# Altium project Lab_Project.PrjPcb
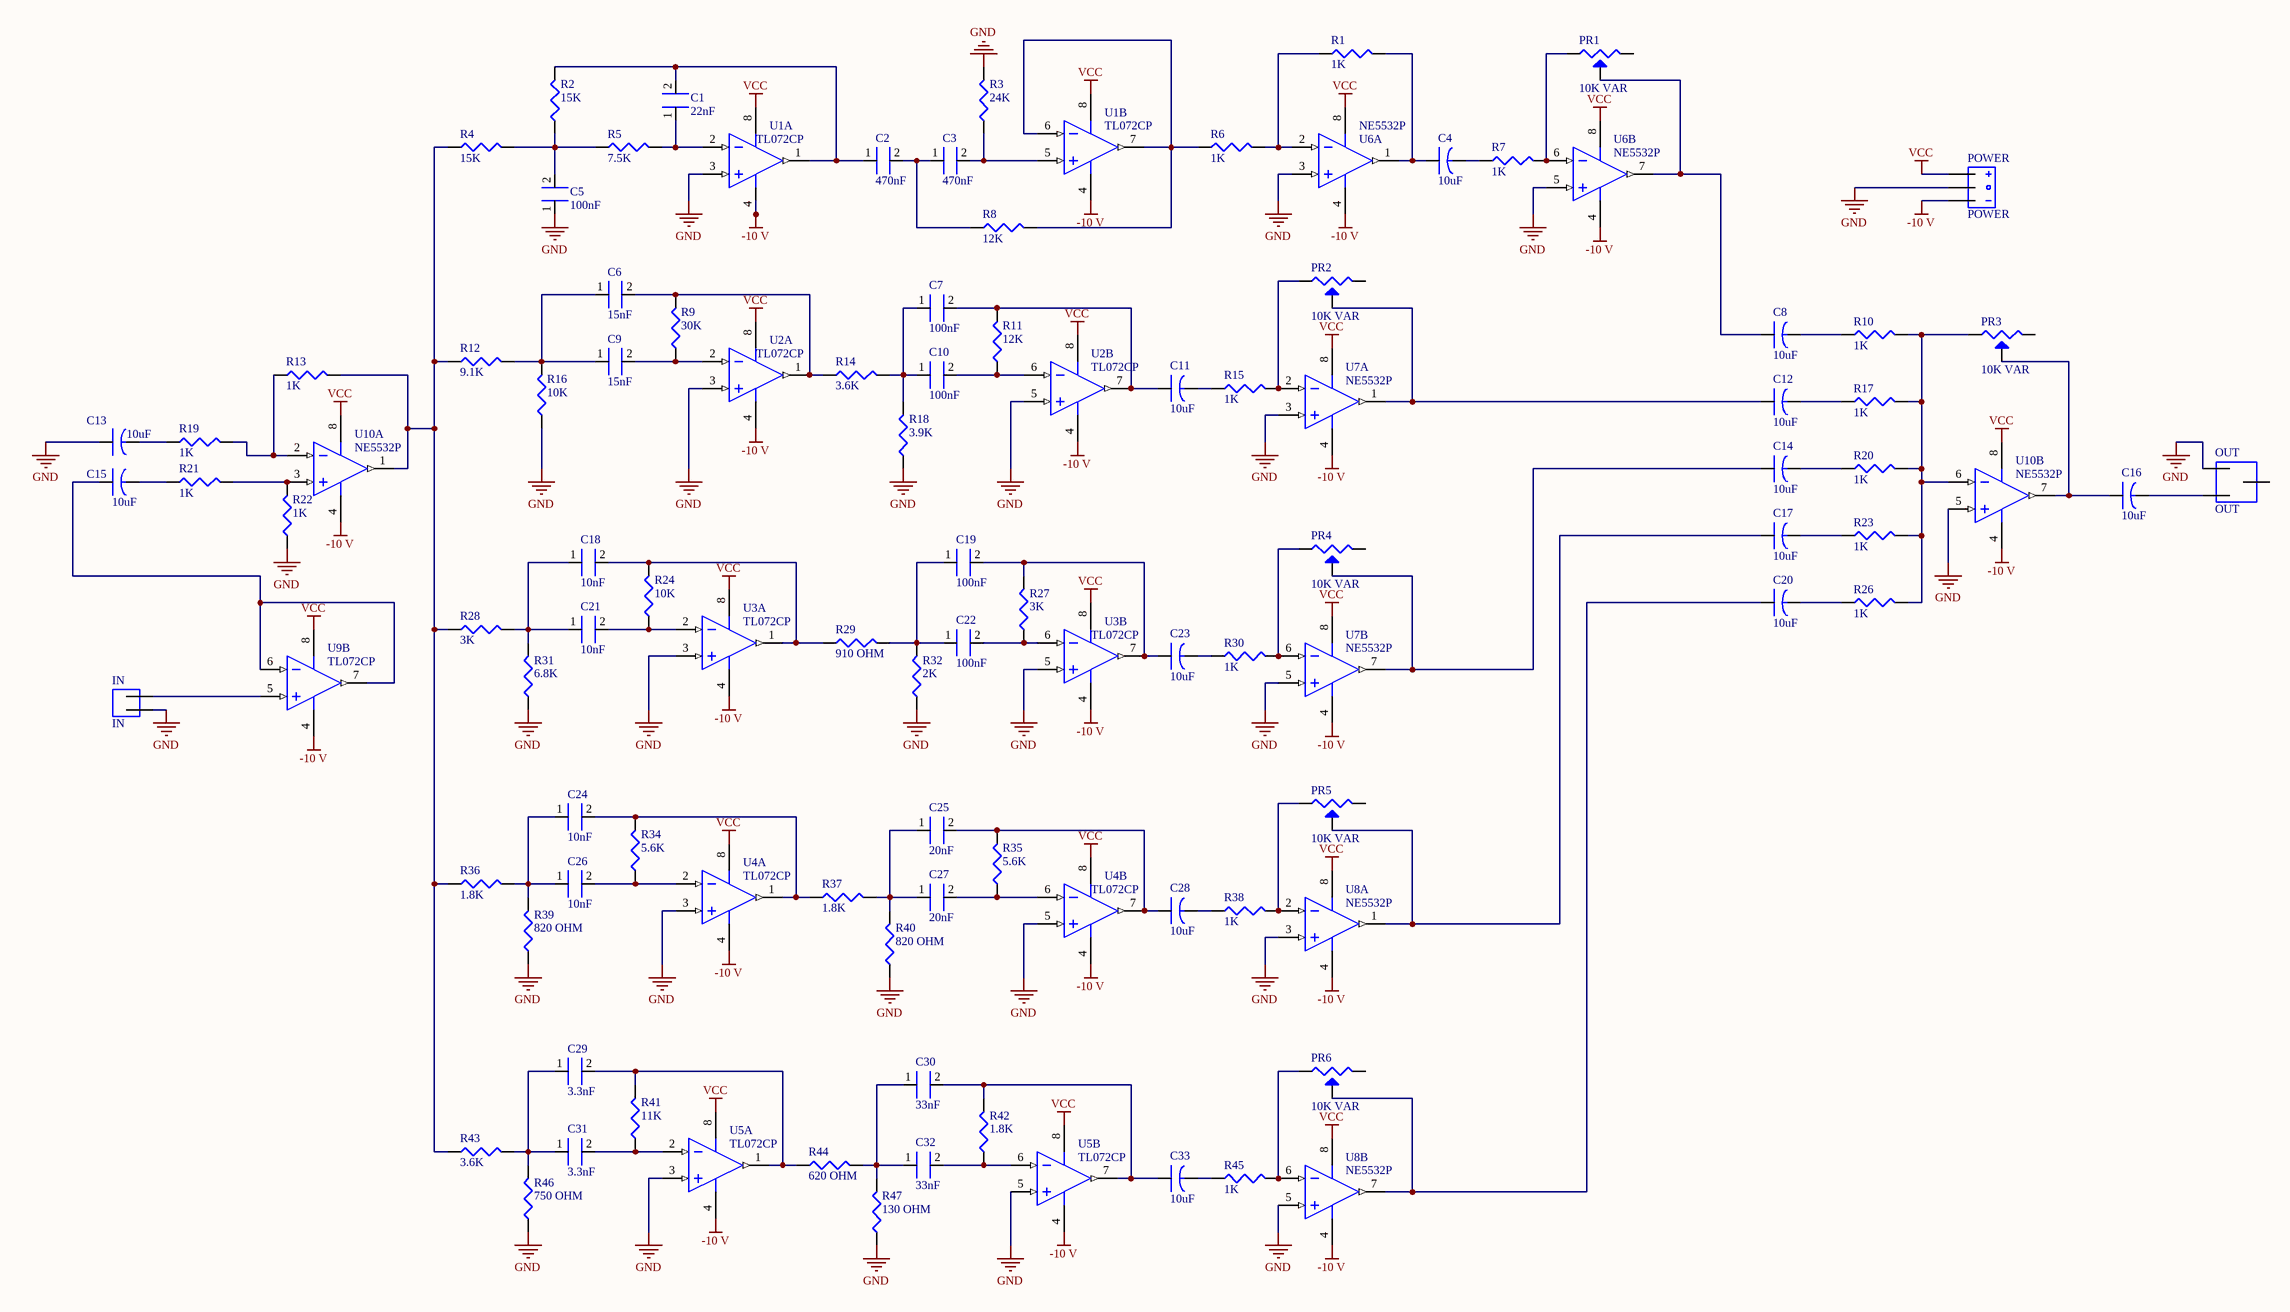
[diagram p0: Sheet1.SchDoc]
1 sheet, 97 parts. Net scope: global (net labels, ports and power ports of the same name join across sheets).
Board file: PCB1.PcbDoc

## Sheet Sheet1.SchDoc
size C; SheetNumber: 1; SheetTotal: 1

### Parts
C1  22nF  [10nF]
C2  470nF  [100nf]
C3  470nF  [100nf]
C4  10uF  [10uF]
C5  100nF  [100nf]
C6  15nF  [10nF]
C7  100nF  [100nf]
C8  10uF  [10uF]
C9  15nF  [10nF]
C10  100nF  [100nf]
C11  10uF  [10uF]
C12  10uF  [10uF]
C13  10uF  [10uF]
C14  10uF  [10uF]
C15  10uF  [10uF]
C16  10uF  [10uF]
C17  10uF  [10uF]
C18  10nF  [10nF]
C19  100nF  [100nf]
C20  10uF  [10uF]
C21  10nF  [10nF]
C22  100nF  [100nf]
C23  10uF  [10uF]
C24  10nF  [10nF]
C25  20nF  [10nF]
C26  10nF  [10nF]
C27  20nF  [10nF]
C28  10uF  [10uF]
C29  3.3nF  [10nF]
C30  33nF  [10nF]
C31  3.3nF  [10nF]
C32  33nF  [10nF]
C33  10uF  [10uF]
IN  IN  [AUDIO_IN]
OUT  OUT  [AUDIO_OUT]
POWER  POWER  [POWER]
PR1  10K VAR  [POT]
PR2  10K VAR  [POT]
PR3  10K VAR  [POT]
PR4  10K VAR  [POT]
PR5  10K VAR  [POT]
PR6  10K VAR  [POT]
R1  1K  [RESI]
R2  15K  [RESI]
R3  24K  [RESI]
R4  15K  [RESI]
R5  7.5K  [RESI]
R6  1K  [RESI]
R7  1K  [RESI]
R8  12K  [RESI]
R9  30K  [RESI]
R10  1K  [RESI]
R11  12K  [RESI]
R12  9.1K  [RESI]
R13  1K  [RESI]
R14  3.6K  [RESI]
R15  1K  [RESI]
R16  10K  [RESI]
R17  1K  [RESI]
R18  3.9K  [RESI]
R19  1K  [RESI]
R20  1K  [RESI]
R21  1K  [RESI]
R22  1K  [RESI]
R23  1K  [RESI]
R24  10K  [RESI]
R26  1K  [RESI]
R27  3K  [RESI]
R28  3K  [RESI]
R29  910 OHM  [RESI]
R30  1K  [RESI]
R31  6.8K  [RESI]
R32  2K  [RESI]
R34  5.6K  [RESI]
R35  5.6K  [RESI]
R36  1.8K  [RESI]
R37  1.8K  [RESI]
R38  1K  [RESI]
R39  820 OHM  [RESI]
R40  820 OHM  [RESI]
R41  11K  [RESI]
R42  1.8K  [RESI]
R43  3.6K  [RESI]
R44  620 OHM  [RESI]
R45  1K  [RESI]
R46  750 OHM  [RESI]
R47  130 OHM  [RESI]
U1  TL072CP  [TL0072CP]  (parts A,B of 2)
U2  TL072CP  [TL0072CP]  (parts A,B of 2)
U3  TL072CP  [TL0072CP]  (parts A,B of 2)
U4  TL072CP  [TL0072CP]  (parts A,B of 2)
U5  TL072CP  [TL0072CP]  (parts A,B of 2)
U6  NE5532P  [NE5532P]  (parts A,B of 2)
U7  NE5532P  [NE5532P]  (parts A,B of 2)
U8  NE5532P  [NE5532P]  (parts A,B of 2)
U9  TL072CP  [TL0072CP]  (part B of 2)
U10  NE5532P  [NE5532P]  (parts A,B of 2)

### Nets
-10 V: POWER.3 U1.4(VCC-) U2.4(VCC-) U3.4(VCC-) U4.4(VCC-) U5.4(VCC-) U6.4(VCC-) U7.4(VCC-) U8.4(VCC-) U9.4(VCC-) U10.4(VCC-)
GND: C5.1 C13.1 IN.1 OUT.2 POWER.2 R3.2 R16.1 R18.1 R22.1 R31.1 R32.1 R39.1 R40.1 R46.1 R47.1 U1.3(IN1+) U2.3(IN1+) U2.5(IN2+) U3.3(IN1+) U3.5(IN2+) U4.3(IN1+) U4.5(IN2+) U5.3(IN1+) U5.5(IN2+) U6.3(IN1+) U6.5(IN2+) U7.3(IN1+) U7.5(IN2+) U8.3(IN1+) U8.5(IN2+) U10.5(IN2+)
VCC: POWER.1 U1.8(VCC+) U2.8(VCC+) U3.8(VCC+) U4.8(VCC+) U5.8(VCC+) U6.8(VCC+) U7.8(VCC+) U8.8(VCC+) U9.8(VCC+) U10.8(VCC+)
NetC1_1: C1.1 R5.2 U1.2(IN1-)
NetC1_2: C1.2 C2.1 R2.2 U1.1(OUT1)
NetC2_2: C2.2 C3.1 R8.1
NetC3_2: C3.2 R3.1 U1.5(IN2+)
NetC4_1: C4.1 R1.2 U6.1(OUT1)
NetC4_2: C4.2 R7.1
NetC5_2: C5.2 R2.1 R4.2 R5.1
NetC6_1: C6.1 C9.1 R12.2 R16.2
NetC6_2: C6.2 R9.2 R14.1 U2.1(OUT1)
NetC7_1: C7.1 C10.1 R14.2 R18.2
NetC7_2: C7.2 C11.1 R11.2 U2.7(OUT2)
NetC8_1: C8.1 PR1.2 U6.7(OUT2)
NetC8_2: C8.2 R10.1
NetC9_2: C9.2 R9.1 U2.2(IN1-)
NetC10_2: C10.2 R11.1 U2.6(IN2-)
NetC11_2: C11.2 R15.1
NetC12_1: C12.1 PR2.2 U7.1(OUT1)
NetC12_2: C12.2 R17.1
NetC13_2: C13.2 R19.1
NetC14_1: C14.1 PR4.2 U7.7(OUT2)
NetC14_2: C14.2 R20.1
NetC15_1: C15.1 U9.6(IN2-) U9.7(OUT2)
NetC15_2: C15.2 R21.1
NetC16_1: C16.1 PR3.2 U10.7(OUT2)
NetC16_2: C16.2 OUT.3
NetC17_1: C17.1 PR5.2 U8.1(OUT1)
NetC17_2: C17.2 R23.1
NetC18_1: C18.1 C21.1 R28.2 R31.2
NetC18_2: C18.2 R24.2 R29.1 U3.1(OUT1)
NetC19_1: C19.1 C22.1 R29.2 R32.2
NetC19_2: C19.2 C23.1 R27.2 U3.7(OUT2)
NetC20_1: C20.1 PR6.2 U8.7(OUT2)
NetC20_2: C20.2 R26.1
NetC21_2: C21.2 R24.1 U3.2(IN1-)
NetC22_2: C22.2 R27.1 U3.6(IN2-)
NetC23_2: C23.2 R30.1
NetC24_1: C24.1 C26.1 R36.2 R39.2
NetC24_2: C24.2 R34.2 R37.1 U4.1(OUT1)
NetC25_1: C25.1 C27.1 R37.2 R40.2
NetC25_2: C25.2 C28.1 R35.2 U4.7(OUT2)
NetC26_2: C26.2 R34.1 U4.2(IN1-)
NetC27_2: C27.2 R35.1 U4.6(IN2-)
NetC28_2: C28.2 R38.1
NetC29_1: C29.1 C31.1 R43.2 R46.2
NetC29_2: C29.2 R41.2 R44.1 U5.1(OUT1)
NetC30_1: C30.1 C32.1 R44.2 R47.2
NetC30_2: C30.2 C33.1 R42.2 U5.7(OUT2)
NetC31_2: C31.2 R41.1 U5.2(IN1-)
NetC32_2: C32.2 R42.1 U5.6(IN2-)
NetC33_2: C33.2 R45.1
NetIN_2: IN.2 U9.5(IN2+)
NetPR1_1: PR1.1 R7.2 U6.6(IN2-)
NetPR2_1: PR2.1 R15.2 U7.2(IN1-)
NetPR3_1: PR3.1 R10.2 R17.2 R20.2 R23.2 R26.2 U10.6(IN2-)
NetPR4_1: PR4.1 R30.2 U7.6(IN2-)
NetPR5_1: PR5.1 R38.2 U8.2(IN1-)
NetPR6_1: PR6.1 R45.2 U8.6(IN2-)
NetR1_1: R1.1 R6.2 U6.2(IN1-)
NetR4_1: R4.1 R12.1 R13.2 R28.1 R36.1 R43.1 U10.1(OUT1)
NetR6_1: R6.1 R8.2 U1.6(IN2-) U1.7(OUT2)
NetR13_1: R13.1 R19.2 U10.2(IN1-)
NetR21_2: R21.2 R22.2 U10.3(IN1+)

Not connected (* = marked no-connect by the designer): OUT 1; PR1 3; PR2 3; PR3 3; PR4 3; PR5 3; PR6 3

### Library data of the parts
C1 = 22nF: Manufacturer: Nichicon; Manufacturer Part Number: UKW1H0R1MDD1TD; Capacitance: 100nF; Tolerance: 20%; Voltage Rating: 50V; Ripple Current: 1.1mA; Life (Hours): 2000Hour; Supplier 1: Digi-Key; RoHS: Yes; Category: Aluminum Electrolytic Capacitors; Stock 1: 3707; Pricing 1: 1=0.39000, 10=0.26600, 50=0.17720, 100=0.15050, 500=0.10626, 1000=0.09298 (USD); Mount: Through Hole; Case/Package: Radial; Min Operating Temperature: -40°C; Max Operating Temperature: 85°C; Package Quantity: 1; Packaging: Cut Tape; Lead Pitch: 0.079inch; Height - Seated (Max): 0.492inch; RoHS Compliant: Yes; ComponentLink1URL: https://datasheet.ciiva.com/29550/e-kw-29550927.pdf?src-supplier=Digi-Key; ComponentLink1Description: https://datasheet.ciiva.com/29550/e-kw-29550927.pdf?src-supplier=Digi-Key; Supplier Part Number 1: 493-10793-1-ND
C2 C3 = 470nF: Manufacturer: Nichicon; Manufacturer Part Number: UKW1H0R1MDD1TD; Tolerance: 20%; Voltage Rating: 50V; Ripple Current: 1.1mA; Life (Hours): 2000Hour; Supplier 1: Digi-Key; RoHS: Yes; Category: Aluminum Electrolytic Capacitors; Stock 1: 3707; Pricing 1: 1=0.39000, 10=0.26600, 50=0.17720, 100=0.15050, 500=0.10626, 1000=0.09298 (USD); Mount: Through Hole; Case/Package: Radial; Min Operating Temperature: -40°C; Max Operating Temperature: 85°C; Package Quantity: 1; Packaging: Cut Tape; Capacitance: 100nF; Lead Pitch: 0.079inch; Height - Seated (Max): 0.492inch; RoHS Compliant: Yes; ComponentLink1URL: https://datasheet.ciiva.com/29550/e-kw-29550927.pdf?src-supplier=Digi-Key; ComponentLink1Description: https://datasheet.ciiva.com/29550/e-kw-29550927.pdf?src-supplier=Digi-Key; Supplier Part Number 1: 493-10793-1-ND
C4 C8 C11-C17 C20 C23 C28 C33 = 10uF: YXF series 50V 10uF 5x11mm LS=2mm 105'C 10k HRS Aluminum Electrolytic Capacitor; Manufacturer: Rubycon; Manufacturer Part Number: 50YXF10MEFC5X11; Dielectric Material: Aluminium; Tolerance: 20%; Impedance: 1.5R; Ripple Current: 100mA; Life (Hours): 5000Hour; Supplier 1: Digi-Key; RoHS: Yes; Category: Aluminum Electrolytic Capacitors; Stock 1: 126340; Pricing 1: 1=0.31000, 10=0.21000, 50=0.12580, 100=0.10620, 500=0.07266, 1000=0.06427, 2500=0.06148, 5000=0.05589 (USD); Mount: Through Hole; Case/Package: Radial; Min Operating Temperature: -40°C; Max Operating Temperature: 105°C; Package Quantity: 3000; Capacitance: 10uF; Voltage Rating: 50V; Packaging: Bulk; Termination: Radial; Series: YXF; Diameter: 5mm; Height: 11mm; Lead Pitch: 2mm; Height - Seated (Max): 0.492inch; Radiation Hardening: No; RoHS Compliant: Yes; ComponentLink1URL: https://datasheet.ciiva.com/7976/e-yxf-7976037.pdf?src-supplier=Element14; ComponentLink1Description: https://datasheet.ciiva.com/7976/e-yxf-7976037.pdf?src-supplier=Element14; ComponentLink2URL: https://datasheet.ciiva.com/6310/e-yxf-6310901.pdf?src-supplier=Digi-Key; ComponentLink2Description: https://datasheet.ciiva.com/6310/e-yxf-6310901.pdf?src-supplier=Digi-Key; Supplier Part Number 1: 1189-1852-ND
C5 C7 C10 C19 C22 = 100nF: Manufacturer: Nichicon; Manufacturer Part Number: UKW1H0R1MDD1TD; Tolerance: 20%; Voltage Rating: 50V; Ripple Current: 1.1mA; Life (Hours): 2000Hour; Supplier 1: Digi-Key; RoHS: Yes; Category: Aluminum Electrolytic Capacitors; Stock 1: 3707; Pricing 1: 1=0.39000, 10=0.26600, 50=0.17720, 100=0.15050, 500=0.10626, 1000=0.09298 (USD); Mount: Through Hole; Case/Package: Radial; Min Operating Temperature: -40°C; Max Operating Temperature: 85°C; Package Quantity: 1; Packaging: Cut Tape; Capacitance: 100nF; Lead Pitch: 0.079inch; Height - Seated (Max): 0.492inch; RoHS Compliant: Yes; ComponentLink1URL: https://datasheet.ciiva.com/29550/e-kw-29550927.pdf?src-supplier=Digi-Key; ComponentLink1Description: https://datasheet.ciiva.com/29550/e-kw-29550927.pdf?src-supplier=Digi-Key; Supplier Part Number 1: 493-10793-1-ND
C6 C9 = 15nF: Manufacturer: Nichicon; Manufacturer Part Number: UKW1H0R1MDD1TD; Capacitance: 100nF; Tolerance: 20%; Voltage Rating: 50V; Ripple Current: 1.1mA; Life (Hours): 2000Hour; Supplier 1: Digi-Key; RoHS: Yes; Category: Aluminum Electrolytic Capacitors; Stock 1: 3707; Pricing 1: 1=0.39000, 10=0.26600, 50=0.17720, 100=0.15050, 500=0.10626, 1000=0.09298 (USD); Mount: Through Hole; Case/Package: Radial; Min Operating Temperature: -40°C; Max Operating Temperature: 85°C; Package Quantity: 1; Packaging: Cut Tape; Lead Pitch: 0.079inch; Height - Seated (Max): 0.492inch; RoHS Compliant: Yes; ComponentLink1URL: https://datasheet.ciiva.com/29550/e-kw-29550927.pdf?src-supplier=Digi-Key; ComponentLink1Description: https://datasheet.ciiva.com/29550/e-kw-29550927.pdf?src-supplier=Digi-Key; Supplier Part Number 1: 493-10793-1-ND
C18 C21 C24 C26 = 10nF: Manufacturer: Nichicon; Manufacturer Part Number: UKW1H0R1MDD1TD; Capacitance: 100nF; Tolerance: 20%; Voltage Rating: 50V; Ripple Current: 1.1mA; Life (Hours): 2000Hour; Supplier 1: Digi-Key; RoHS: Yes; Category: Aluminum Electrolytic Capacitors; Stock 1: 3707; Pricing 1: 1=0.39000, 10=0.26600, 50=0.17720, 100=0.15050, 500=0.10626, 1000=0.09298 (USD); Mount: Through Hole; Case/Package: Radial; Min Operating Temperature: -40°C; Max Operating Temperature: 85°C; Package Quantity: 1; Packaging: Cut Tape; Lead Pitch: 0.079inch; Height - Seated (Max): 0.492inch; RoHS Compliant: Yes; ComponentLink1URL: https://datasheet.ciiva.com/29550/e-kw-29550927.pdf?src-supplier=Digi-Key; ComponentLink1Description: https://datasheet.ciiva.com/29550/e-kw-29550927.pdf?src-supplier=Digi-Key; Supplier Part Number 1: 493-10793-1-ND
C25 C27 = 20nF: Manufacturer: Nichicon; Manufacturer Part Number: UKW1H0R1MDD1TD; Capacitance: 100nF; Tolerance: 20%; Voltage Rating: 50V; Ripple Current: 1.1mA; Life (Hours): 2000Hour; Supplier 1: Digi-Key; RoHS: Yes; Category: Aluminum Electrolytic Capacitors; Stock 1: 3707; Pricing 1: 1=0.39000, 10=0.26600, 50=0.17720, 100=0.15050, 500=0.10626, 1000=0.09298 (USD); Mount: Through Hole; Case/Package: Radial; Min Operating Temperature: -40°C; Max Operating Temperature: 85°C; Package Quantity: 1; Packaging: Cut Tape; Lead Pitch: 0.079inch; Height - Seated (Max): 0.492inch; RoHS Compliant: Yes; ComponentLink1URL: https://datasheet.ciiva.com/29550/e-kw-29550927.pdf?src-supplier=Digi-Key; ComponentLink1Description: https://datasheet.ciiva.com/29550/e-kw-29550927.pdf?src-supplier=Digi-Key; Supplier Part Number 1: 493-10793-1-ND
C29 C31 = 3.3nF: Manufacturer: Nichicon; Manufacturer Part Number: UKW1H0R1MDD1TD; Capacitance: 100nF; Tolerance: 20%; Voltage Rating: 50V; Ripple Current: 1.1mA; Life (Hours): 2000Hour; Supplier 1: Digi-Key; RoHS: Yes; Category: Aluminum Electrolytic Capacitors; Stock 1: 3707; Pricing 1: 1=0.39000, 10=0.26600, 50=0.17720, 100=0.15050, 500=0.10626, 1000=0.09298 (USD); Mount: Through Hole; Case/Package: Radial; Min Operating Temperature: -40°C; Max Operating Temperature: 85°C; Package Quantity: 1; Packaging: Cut Tape; Lead Pitch: 0.079inch; Height - Seated (Max): 0.492inch; RoHS Compliant: Yes; ComponentLink1URL: https://datasheet.ciiva.com/29550/e-kw-29550927.pdf?src-supplier=Digi-Key; ComponentLink1Description: https://datasheet.ciiva.com/29550/e-kw-29550927.pdf?src-supplier=Digi-Key; Supplier Part Number 1: 493-10793-1-ND
C30 C32 = 33nF: Manufacturer: Nichicon; Manufacturer Part Number: UKW1H0R1MDD1TD; Capacitance: 100nF; Tolerance: 20%; Voltage Rating: 50V; Ripple Current: 1.1mA; Life (Hours): 2000Hour; Supplier 1: Digi-Key; RoHS: Yes; Category: Aluminum Electrolytic Capacitors; Stock 1: 3707; Pricing 1: 1=0.39000, 10=0.26600, 50=0.17720, 100=0.15050, 500=0.10626, 1000=0.09298 (USD); Mount: Through Hole; Case/Package: Radial; Min Operating Temperature: -40°C; Max Operating Temperature: 85°C; Package Quantity: 1; Packaging: Cut Tape; Lead Pitch: 0.079inch; Height - Seated (Max): 0.492inch; RoHS Compliant: Yes; ComponentLink1URL: https://datasheet.ciiva.com/29550/e-kw-29550927.pdf?src-supplier=Digi-Key; ComponentLink1Description: https://datasheet.ciiva.com/29550/e-kw-29550927.pdf?src-supplier=Digi-Key; Supplier Part Number 1: 493-10793-1-ND
IN = A_IN
OUT = AUDIO
R1 R6 R7 R10 R13 R15 R17 R19-R23 R26 R30 R38 R45 = 1K: RES 1K OHM 5% 1/2W AXIAL; Manufacturer: Yageo; Manufacturer Part Number: CFR-25JB-52-10K; Resistance: 10kR; Temperature Coefficient: 500ppm/°C; Max Power Dissipation: 250mW; Supplier 1: Digi-Key; RoHS: Yes; Category: Through-Hole Resistors; Stock 1: 199228; Pricing 1: 1=0.10000, 10=0.06800, 25=0.04680, 50=0.03640, 100=0.02600, 250=0.02028, 500=0.01612, 1000=0.01144, 5000=0.00884 (USD); Case/Package: Axial; Min Operating Temperature: -55°C; Max Operating Temperature: 155°C; Package Quantity: 200; Packaging: Bulk; Tolerance: 5%; Resistor Type: Carbon Film; Number of Terminations: 2; Series: Carbon Film; Length: 0.248inch; RoHS Compliant: Yes; Lead Free: Lead Free; ComponentLink1URL: http://www.yageo.com/NewPortal/yageodocoutput?fileName=/pdf/throughhole/Yageo_LR_CFR_2013.pdf&src-supplier=Digi-Key; ComponentLink1Description: http://www.yageo.com/NewPortal/yageodocoutput?fileName=/pdf/throughhole/Yageo_LR_CFR_2013.pdf&src-supplier=Digi-Key; Supplier Part Number 1: CF14JT1K00CT-ND
R2 R4 = 15K: RES 15K OHM 5% 1/2W AXIAL; Manufacturer: Yageo; Manufacturer Part Number: CFR-25JB-52-10K; Resistance: 10kR; Temperature Coefficient: 500ppm/°C; Max Power Dissipation: 250mW; Supplier 1: Digi-Key; RoHS: Yes; Category: Through-Hole Resistors; Stock 1: 199228; Pricing 1: 1=0.10000, 10=0.06800, 25=0.04680, 50=0.03640, 100=0.02600, 250=0.02028, 500=0.01612, 1000=0.01144, 5000=0.00884 (USD); Case/Package: Axial; Min Operating Temperature: -55°C; Max Operating Temperature: 155°C; Package Quantity: 200; Packaging: Bulk; Tolerance: 5%; Resistor Type: Carbon Film; Number of Terminations: 2; Series: Carbon Film; Length: 0.248inch; RoHS Compliant: Yes; Lead Free: Lead Free; ComponentLink1URL: http://www.yageo.com/NewPortal/yageodocoutput?fileName=/pdf/throughhole/Yageo_LR_CFR_2013.pdf&src-supplier=Digi-Key; ComponentLink1Description: http://www.yageo.com/NewPortal/yageodocoutput?fileName=/pdf/throughhole/Yageo_LR_CFR_2013.pdf&src-supplier=Digi-Key; Supplier Part Number 1: 10KQBK-ND
R3 = 24K: RES 24K OHM 5% 1/2W AXIAL; Manufacturer: Yageo; Manufacturer Part Number: CFR-25JB-52-10K; Resistance: 10kR; Temperature Coefficient: 500ppm/°C; Max Power Dissipation: 250mW; Supplier 1: Digi-Key; RoHS: Yes; Category: Through-Hole Resistors; Stock 1: 199228; Pricing 1: 1=0.10000, 10=0.06800, 25=0.04680, 50=0.03640, 100=0.02600, 250=0.02028, 500=0.01612, 1000=0.01144, 5000=0.00884 (USD); Case/Package: Axial; Min Operating Temperature: -55°C; Max Operating Temperature: 155°C; Package Quantity: 200; Packaging: Bulk; Tolerance: 5%; Resistor Type: Carbon Film; Number of Terminations: 2; Series: Carbon Film; Length: 0.248inch; RoHS Compliant: Yes; Lead Free: Lead Free; ComponentLink1URL: http://www.yageo.com/NewPortal/yageodocoutput?fileName=/pdf/throughhole/Yageo_LR_CFR_2013.pdf&src-supplier=Digi-Key; ComponentLink1Description: http://www.yageo.com/NewPortal/yageodocoutput?fileName=/pdf/throughhole/Yageo_LR_CFR_2013.pdf&src-supplier=Digi-Key; Supplier Part Number 1: 10KQBK-ND
R5 = 7.5K: RES 7.5K OHM 5% 1/2W AXIAL; Manufacturer: Yageo; Manufacturer Part Number: CFR-25JB-52-10K; Resistance: 10kR; Temperature Coefficient: 500ppm/°C; Max Power Dissipation: 250mW; Supplier 1: Digi-Key; RoHS: Yes; Category: Through-Hole Resistors; Stock 1: 199228; Pricing 1: 1=0.10000, 10=0.06800, 25=0.04680, 50=0.03640, 100=0.02600, 250=0.02028, 500=0.01612, 1000=0.01144, 5000=0.00884 (USD); Case/Package: Axial; Min Operating Temperature: -55°C; Max Operating Temperature: 155°C; Package Quantity: 200; Packaging: Bulk; Tolerance: 5%; Resistor Type: Carbon Film; Number of Terminations: 2; Series: Carbon Film; Length: 0.248inch; RoHS Compliant: Yes; Lead Free: Lead Free; ComponentLink1URL: http://www.yageo.com/NewPortal/yageodocoutput?fileName=/pdf/throughhole/Yageo_LR_CFR_2013.pdf&src-supplier=Digi-Key; ComponentLink1Description: http://www.yageo.com/NewPortal/yageodocoutput?fileName=/pdf/throughhole/Yageo_LR_CFR_2013.pdf&src-supplier=Digi-Key; Supplier Part Number 1: 10KQBK-ND
R8 R11 = 12K: RES 12K OHM 5% 1/2W AXIAL; Manufacturer: Yageo; Manufacturer Part Number: CFR-25JB-52-10K; Resistance: 10kR; Temperature Coefficient: 500ppm/°C; Max Power Dissipation: 250mW; Supplier 1: Digi-Key; RoHS: Yes; Category: Through-Hole Resistors; Stock 1: 199228; Pricing 1: 1=0.10000, 10=0.06800, 25=0.04680, 50=0.03640, 100=0.02600, 250=0.02028, 500=0.01612, 1000=0.01144, 5000=0.00884 (USD); Case/Package: Axial; Min Operating Temperature: -55°C; Max Operating Temperature: 155°C; Package Quantity: 200; Packaging: Bulk; Tolerance: 5%; Resistor Type: Carbon Film; Number of Terminations: 2; Series: Carbon Film; Length: 0.248inch; RoHS Compliant: Yes; Lead Free: Lead Free; ComponentLink1URL: http://www.yageo.com/NewPortal/yageodocoutput?fileName=/pdf/throughhole/Yageo_LR_CFR_2013.pdf&src-supplier=Digi-Key; ComponentLink1Description: http://www.yageo.com/NewPortal/yageodocoutput?fileName=/pdf/throughhole/Yageo_LR_CFR_2013.pdf&src-supplier=Digi-Key; Supplier Part Number 1: 10KQBK-ND
R9 = 30K: RES 30K OHM 5% 1/2W AXIAL; Manufacturer: Yageo; Manufacturer Part Number: CFR-25JB-52-10K; Resistance: 10kR; Temperature Coefficient: 500ppm/°C; Max Power Dissipation: 250mW; Supplier 1: Digi-Key; RoHS: Yes; Category: Through-Hole Resistors; Stock 1: 199228; Pricing 1: 1=0.10000, 10=0.06800, 25=0.04680, 50=0.03640, 100=0.02600, 250=0.02028, 500=0.01612, 1000=0.01144, 5000=0.00884 (USD); Case/Package: Axial; Min Operating Temperature: -55°C; Max Operating Temperature: 155°C; Package Quantity: 200; Packaging: Bulk; Tolerance: 5%; Resistor Type: Carbon Film; Number of Terminations: 2; Series: Carbon Film; Length: 0.248inch; RoHS Compliant: Yes; Lead Free: Lead Free; ComponentLink1URL: http://www.yageo.com/NewPortal/yageodocoutput?fileName=/pdf/throughhole/Yageo_LR_CFR_2013.pdf&src-supplier=Digi-Key; ComponentLink1Description: http://www.yageo.com/NewPortal/yageodocoutput?fileName=/pdf/throughhole/Yageo_LR_CFR_2013.pdf&src-supplier=Digi-Key; Supplier Part Number 1: 10KQBK-ND
R12 = 9.1K: RES 9.1K OHM 5% 1/2W AXIAL; Manufacturer: Yageo; Manufacturer Part Number: CFR-25JB-52-10K; Resistance: 10kR; Temperature Coefficient: 500ppm/°C; Max Power Dissipation: 250mW; Supplier 1: Digi-Key; RoHS: Yes; Category: Through-Hole Resistors; Stock 1: 199228; Pricing 1: 1=0.10000, 10=0.06800, 25=0.04680, 50=0.03640, 100=0.02600, 250=0.02028, 500=0.01612, 1000=0.01144, 5000=0.00884 (USD); Case/Package: Axial; Min Operating Temperature: -55°C; Max Operating Temperature: 155°C; Package Quantity: 200; Packaging: Bulk; Tolerance: 5%; Resistor Type: Carbon Film; Number of Terminations: 2; Series: Carbon Film; Length: 0.248inch; RoHS Compliant: Yes; Lead Free: Lead Free; ComponentLink1URL: http://www.yageo.com/NewPortal/yageodocoutput?fileName=/pdf/throughhole/Yageo_LR_CFR_2013.pdf&src-supplier=Digi-Key; ComponentLink1Description: http://www.yageo.com/NewPortal/yageodocoutput?fileName=/pdf/throughhole/Yageo_LR_CFR_2013.pdf&src-supplier=Digi-Key; Supplier Part Number 1: 10KQBK-ND
R14 R43 = 3.6K: RES 3.6K OHM 5% 1/2W AXIAL; Manufacturer: Yageo; Manufacturer Part Number: CFR-25JB-52-10K; Resistance: 10kR; Temperature Coefficient: 500ppm/°C; Max Power Dissipation: 250mW; Supplier 1: Digi-Key; RoHS: Yes; Category: Through-Hole Resistors; Stock 1: 199228; Pricing 1: 1=0.10000, 10=0.06800, 25=0.04680, 50=0.03640, 100=0.02600, 250=0.02028, 500=0.01612, 1000=0.01144, 5000=0.00884 (USD); Case/Package: Axial; Min Operating Temperature: -55°C; Max Operating Temperature: 155°C; Package Quantity: 200; Packaging: Bulk; Tolerance: 5%; Resistor Type: Carbon Film; Number of Terminations: 2; Series: Carbon Film; Length: 0.248inch; RoHS Compliant: Yes; Lead Free: Lead Free; ComponentLink1URL: http://www.yageo.com/NewPortal/yageodocoutput?fileName=/pdf/throughhole/Yageo_LR_CFR_2013.pdf&src-supplier=Digi-Key; ComponentLink1Description: http://www.yageo.com/NewPortal/yageodocoutput?fileName=/pdf/throughhole/Yageo_LR_CFR_2013.pdf&src-supplier=Digi-Key; Supplier Part Number 1: 10KQBK-ND
R16 R24 = 10K: RES 10K OHM 5% 1/2W AXIAL; Manufacturer: Yageo; Manufacturer Part Number: CFR-25JB-52-10K; Resistance: 10kR; Temperature Coefficient: 500ppm/°C; Max Power Dissipation: 250mW; Supplier 1: Digi-Key; RoHS: Yes; Category: Through-Hole Resistors; Stock 1: 199228; Pricing 1: 1=0.10000, 10=0.06800, 25=0.04680, 50=0.03640, 100=0.02600, 250=0.02028, 500=0.01612, 1000=0.01144, 5000=0.00884 (USD); Case/Package: Axial; Min Operating Temperature: -55°C; Max Operating Temperature: 155°C; Package Quantity: 200; Packaging: Bulk; Tolerance: 5%; Resistor Type: Carbon Film; Number of Terminations: 2; Series: Carbon Film; Length: 0.248inch; RoHS Compliant: Yes; Lead Free: Lead Free; ComponentLink1URL: http://www.yageo.com/NewPortal/yageodocoutput?fileName=/pdf/throughhole/Yageo_LR_CFR_2013.pdf&src-supplier=Digi-Key; ComponentLink1Description: http://www.yageo.com/NewPortal/yageodocoutput?fileName=/pdf/throughhole/Yageo_LR_CFR_2013.pdf&src-supplier=Digi-Key; Supplier Part Number 1: 10KQBK-ND
R18 = 3.9K: RES 3.9K OHM 5% 1/2W AXIAL; Manufacturer: Yageo; Manufacturer Part Number: CFR-25JB-52-10K; Resistance: 10kR; Temperature Coefficient: 500ppm/°C; Max Power Dissipation: 250mW; Supplier 1: Digi-Key; RoHS: Yes; Category: Through-Hole Resistors; Stock 1: 199228; Pricing 1: 1=0.10000, 10=0.06800, 25=0.04680, 50=0.03640, 100=0.02600, 250=0.02028, 500=0.01612, 1000=0.01144, 5000=0.00884 (USD); Case/Package: Axial; Min Operating Temperature: -55°C; Max Operating Temperature: 155°C; Package Quantity: 200; Packaging: Bulk; Tolerance: 5%; Resistor Type: Carbon Film; Number of Terminations: 2; Series: Carbon Film; Length: 0.248inch; RoHS Compliant: Yes; Lead Free: Lead Free; ComponentLink1URL: http://www.yageo.com/NewPortal/yageodocoutput?fileName=/pdf/throughhole/Yageo_LR_CFR_2013.pdf&src-supplier=Digi-Key; ComponentLink1Description: http://www.yageo.com/NewPortal/yageodocoutput?fileName=/pdf/throughhole/Yageo_LR_CFR_2013.pdf&src-supplier=Digi-Key; Supplier Part Number 1: 10KQBK-ND
R27 R28 = 3K: RES 3K OHM 5% 1/2W AXIAL; Manufacturer: Yageo; Manufacturer Part Number: CFR-25JB-52-10K; Resistance: 10kR; Temperature Coefficient: 500ppm/°C; Max Power Dissipation: 250mW; Supplier 1: Digi-Key; RoHS: Yes; Category: Through-Hole Resistors; Stock 1: 199228; Pricing 1: 1=0.10000, 10=0.06800, 25=0.04680, 50=0.03640, 100=0.02600, 250=0.02028, 500=0.01612, 1000=0.01144, 5000=0.00884 (USD); Case/Package: Axial; Min Operating Temperature: -55°C; Max Operating Temperature: 155°C; Package Quantity: 200; Packaging: Bulk; Tolerance: 5%; Resistor Type: Carbon Film; Number of Terminations: 2; Series: Carbon Film; Length: 0.248inch; RoHS Compliant: Yes; Lead Free: Lead Free; ComponentLink1URL: http://www.yageo.com/NewPortal/yageodocoutput?fileName=/pdf/throughhole/Yageo_LR_CFR_2013.pdf&src-supplier=Digi-Key; ComponentLink1Description: http://www.yageo.com/NewPortal/yageodocoutput?fileName=/pdf/throughhole/Yageo_LR_CFR_2013.pdf&src-supplier=Digi-Key; Supplier Part Number 1: 10KQBK-ND
R29 = 910 OHM: RES 910 OHM 5% 1/2W AXIAL; Manufacturer: Yageo; Manufacturer Part Number: CFR-25JB-52-10K; Resistance: 10kR; Temperature Coefficient: 500ppm/°C; Max Power Dissipation: 250mW; Supplier 1: Digi-Key; RoHS: Yes; Category: Through-Hole Resistors; Stock 1: 199228; Pricing 1: 1=0.10000, 10=0.06800, 25=0.04680, 50=0.03640, 100=0.02600, 250=0.02028, 500=0.01612, 1000=0.01144, 5000=0.00884 (USD); Case/Package: Axial; Min Operating Temperature: -55°C; Max Operating Temperature: 155°C; Package Quantity: 200; Packaging: Bulk; Tolerance: 5%; Resistor Type: Carbon Film; Number of Terminations: 2; Series: Carbon Film; Length: 0.248inch; RoHS Compliant: Yes; Lead Free: Lead Free; ComponentLink1URL: http://www.yageo.com/NewPortal/yageodocoutput?fileName=/pdf/throughhole/Yageo_LR_CFR_2013.pdf&src-supplier=Digi-Key; ComponentLink1Description: http://www.yageo.com/NewPortal/yageodocoutput?fileName=/pdf/throughhole/Yageo_LR_CFR_2013.pdf&src-supplier=Digi-Key; Supplier Part Number 1: 10KQBK-ND
R31 = 6.8K: RES 6.8K OHM 5% 1/2W AXIAL; Manufacturer: Yageo; Manufacturer Part Number: CFR-25JB-52-10K; Resistance: 10kR; Temperature Coefficient: 500ppm/°C; Max Power Dissipation: 250mW; Supplier 1: Digi-Key; RoHS: Yes; Category: Through-Hole Resistors; Stock 1: 199228; Pricing 1: 1=0.10000, 10=0.06800, 25=0.04680, 50=0.03640, 100=0.02600, 250=0.02028, 500=0.01612, 1000=0.01144, 5000=0.00884 (USD); Case/Package: Axial; Min Operating Temperature: -55°C; Max Operating Temperature: 155°C; Package Quantity: 200; Packaging: Bulk; Tolerance: 5%; Resistor Type: Carbon Film; Number of Terminations: 2; Series: Carbon Film; Length: 0.248inch; RoHS Compliant: Yes; Lead Free: Lead Free; ComponentLink1URL: http://www.yageo.com/NewPortal/yageodocoutput?fileName=/pdf/throughhole/Yageo_LR_CFR_2013.pdf&src-supplier=Digi-Key; ComponentLink1Description: http://www.yageo.com/NewPortal/yageodocoutput?fileName=/pdf/throughhole/Yageo_LR_CFR_2013.pdf&src-supplier=Digi-Key; Supplier Part Number 1: 10KQBK-ND
R32 = 2K: RES 2K OHM 5% 1/2W AXIAL; Manufacturer: Yageo; Manufacturer Part Number: CFR-25JB-52-10K; Resistance: 10kR; Temperature Coefficient: 500ppm/°C; Max Power Dissipation: 250mW; Supplier 1: Digi-Key; RoHS: Yes; Category: Through-Hole Resistors; Stock 1: 199228; Pricing 1: 1=0.10000, 10=0.06800, 25=0.04680, 50=0.03640, 100=0.02600, 250=0.02028, 500=0.01612, 1000=0.01144, 5000=0.00884 (USD); Case/Package: Axial; Min Operating Temperature: -55°C; Max Operating Temperature: 155°C; Package Quantity: 200; Packaging: Bulk; Tolerance: 5%; Resistor Type: Carbon Film; Number of Terminations: 2; Series: Carbon Film; Length: 0.248inch; RoHS Compliant: Yes; Lead Free: Lead Free; ComponentLink1URL: http://www.yageo.com/NewPortal/yageodocoutput?fileName=/pdf/throughhole/Yageo_LR_CFR_2013.pdf&src-supplier=Digi-Key; ComponentLink1Description: http://www.yageo.com/NewPortal/yageodocoutput?fileName=/pdf/throughhole/Yageo_LR_CFR_2013.pdf&src-supplier=Digi-Key; Supplier Part Number 1: 10KQBK-ND
R34 R35 = 5.6K: RES 5.6K OHM 5% 1/2W AXIAL; Manufacturer: Yageo; Manufacturer Part Number: CFR-25JB-52-10K; Resistance: 10kR; Temperature Coefficient: 500ppm/°C; Max Power Dissipation: 250mW; Supplier 1: Digi-Key; RoHS: Yes; Category: Through-Hole Resistors; Stock 1: 199228; Pricing 1: 1=0.10000, 10=0.06800, 25=0.04680, 50=0.03640, 100=0.02600, 250=0.02028, 500=0.01612, 1000=0.01144, 5000=0.00884 (USD); Case/Package: Axial; Min Operating Temperature: -55°C; Max Operating Temperature: 155°C; Package Quantity: 200; Packaging: Bulk; Tolerance: 5%; Resistor Type: Carbon Film; Number of Terminations: 2; Series: Carbon Film; Length: 0.248inch; RoHS Compliant: Yes; Lead Free: Lead Free; ComponentLink1URL: http://www.yageo.com/NewPortal/yageodocoutput?fileName=/pdf/throughhole/Yageo_LR_CFR_2013.pdf&src-supplier=Digi-Key; ComponentLink1Description: http://www.yageo.com/NewPortal/yageodocoutput?fileName=/pdf/throughhole/Yageo_LR_CFR_2013.pdf&src-supplier=Digi-Key; Supplier Part Number 1: 10KQBK-ND
R36 R37 R42 = 1.8K: RES 1.8K OHM 5% 1/2W AXIAL; Manufacturer: Yageo; Manufacturer Part Number: CFR-25JB-52-10K; Resistance: 10kR; Temperature Coefficient: 500ppm/°C; Max Power Dissipation: 250mW; Supplier 1: Digi-Key; RoHS: Yes; Category: Through-Hole Resistors; Stock 1: 199228; Pricing 1: 1=0.10000, 10=0.06800, 25=0.04680, 50=0.03640, 100=0.02600, 250=0.02028, 500=0.01612, 1000=0.01144, 5000=0.00884 (USD); Case/Package: Axial; Min Operating Temperature: -55°C; Max Operating Temperature: 155°C; Package Quantity: 200; Packaging: Bulk; Tolerance: 5%; Resistor Type: Carbon Film; Number of Terminations: 2; Series: Carbon Film; Length: 0.248inch; RoHS Compliant: Yes; Lead Free: Lead Free; ComponentLink1URL: http://www.yageo.com/NewPortal/yageodocoutput?fileName=/pdf/throughhole/Yageo_LR_CFR_2013.pdf&src-supplier=Digi-Key; ComponentLink1Description: http://www.yageo.com/NewPortal/yageodocoutput?fileName=/pdf/throughhole/Yageo_LR_CFR_2013.pdf&src-supplier=Digi-Key; Supplier Part Number 1: 10KQBK-ND
R39 R40 = 820 OHM: RES 820 OHM 5% 1/2W AXIAL; Manufacturer: Yageo; Manufacturer Part Number: CFR-25JB-52-10K; Resistance: 10kR; Temperature Coefficient: 500ppm/°C; Max Power Dissipation: 250mW; Supplier 1: Digi-Key; RoHS: Yes; Category: Through-Hole Resistors; Stock 1: 199228; Pricing 1: 1=0.10000, 10=0.06800, 25=0.04680, 50=0.03640, 100=0.02600, 250=0.02028, 500=0.01612, 1000=0.01144, 5000=0.00884 (USD); Case/Package: Axial; Min Operating Temperature: -55°C; Max Operating Temperature: 155°C; Package Quantity: 200; Packaging: Bulk; Tolerance: 5%; Resistor Type: Carbon Film; Number of Terminations: 2; Series: Carbon Film; Length: 0.248inch; RoHS Compliant: Yes; Lead Free: Lead Free; ComponentLink1URL: http://www.yageo.com/NewPortal/yageodocoutput?fileName=/pdf/throughhole/Yageo_LR_CFR_2013.pdf&src-supplier=Digi-Key; ComponentLink1Description: http://www.yageo.com/NewPortal/yageodocoutput?fileName=/pdf/throughhole/Yageo_LR_CFR_2013.pdf&src-supplier=Digi-Key; Supplier Part Number 1: 10KQBK-ND
R41 = 11K: RES 11K OHM 5% 1/2W AXIAL; Manufacturer: Yageo; Manufacturer Part Number: CFR-25JB-52-10K; Resistance: 10kR; Temperature Coefficient: 500ppm/°C; Max Power Dissipation: 250mW; Supplier 1: Digi-Key; RoHS: Yes; Category: Through-Hole Resistors; Stock 1: 199228; Pricing 1: 1=0.10000, 10=0.06800, 25=0.04680, 50=0.03640, 100=0.02600, 250=0.02028, 500=0.01612, 1000=0.01144, 5000=0.00884 (USD); Case/Package: Axial; Min Operating Temperature: -55°C; Max Operating Temperature: 155°C; Package Quantity: 200; Packaging: Bulk; Tolerance: 5%; Resistor Type: Carbon Film; Number of Terminations: 2; Series: Carbon Film; Length: 0.248inch; RoHS Compliant: Yes; Lead Free: Lead Free; ComponentLink1URL: http://www.yageo.com/NewPortal/yageodocoutput?fileName=/pdf/throughhole/Yageo_LR_CFR_2013.pdf&src-supplier=Digi-Key; ComponentLink1Description: http://www.yageo.com/NewPortal/yageodocoutput?fileName=/pdf/throughhole/Yageo_LR_CFR_2013.pdf&src-supplier=Digi-Key; Supplier Part Number 1: 10KQBK-ND
R44 = 620 OHM: RES 620 OHM 5% 1/2W AXIAL; Manufacturer: Yageo; Manufacturer Part Number: CFR-25JB-52-10K; Resistance: 10kR; Temperature Coefficient: 500ppm/°C; Max Power Dissipation: 250mW; Supplier 1: Digi-Key; RoHS: Yes; Category: Through-Hole Resistors; Stock 1: 199228; Pricing 1: 1=0.10000, 10=0.06800, 25=0.04680, 50=0.03640, 100=0.02600, 250=0.02028, 500=0.01612, 1000=0.01144, 5000=0.00884 (USD); Case/Package: Axial; Min Operating Temperature: -55°C; Max Operating Temperature: 155°C; Package Quantity: 200; Packaging: Bulk; Tolerance: 5%; Resistor Type: Carbon Film; Number of Terminations: 2; Series: Carbon Film; Length: 0.248inch; RoHS Compliant: Yes; Lead Free: Lead Free; ComponentLink1URL: http://www.yageo.com/NewPortal/yageodocoutput?fileName=/pdf/throughhole/Yageo_LR_CFR_2013.pdf&src-supplier=Digi-Key; ComponentLink1Description: http://www.yageo.com/NewPortal/yageodocoutput?fileName=/pdf/throughhole/Yageo_LR_CFR_2013.pdf&src-supplier=Digi-Key; Supplier Part Number 1: 10KQBK-ND
R46 = 750 OHM: RES 750 OHM 5% 1/2W AXIAL; Manufacturer: Yageo; Manufacturer Part Number: CFR-25JB-52-10K; Resistance: 10kR; Temperature Coefficient: 500ppm/°C; Max Power Dissipation: 250mW; Supplier 1: Digi-Key; RoHS: Yes; Category: Through-Hole Resistors; Stock 1: 199228; Pricing 1: 1=0.10000, 10=0.06800, 25=0.04680, 50=0.03640, 100=0.02600, 250=0.02028, 500=0.01612, 1000=0.01144, 5000=0.00884 (USD); Case/Package: Axial; Min Operating Temperature: -55°C; Max Operating Temperature: 155°C; Package Quantity: 200; Packaging: Bulk; Tolerance: 5%; Resistor Type: Carbon Film; Number of Terminations: 2; Series: Carbon Film; Length: 0.248inch; RoHS Compliant: Yes; Lead Free: Lead Free; ComponentLink1URL: http://www.yageo.com/NewPortal/yageodocoutput?fileName=/pdf/throughhole/Yageo_LR_CFR_2013.pdf&src-supplier=Digi-Key; ComponentLink1Description: http://www.yageo.com/NewPortal/yageodocoutput?fileName=/pdf/throughhole/Yageo_LR_CFR_2013.pdf&src-supplier=Digi-Key; Supplier Part Number 1: 10KQBK-ND
R47 = 130 OHM: RES 130 OHM 5% 1/2W AXIAL; Manufacturer: Yageo; Manufacturer Part Number: CFR-25JB-52-10K; Resistance: 10kR; Temperature Coefficient: 500ppm/°C; Max Power Dissipation: 250mW; Supplier 1: Digi-Key; RoHS: Yes; Category: Through-Hole Resistors; Stock 1: 199228; Pricing 1: 1=0.10000, 10=0.06800, 25=0.04680, 50=0.03640, 100=0.02600, 250=0.02028, 500=0.01612, 1000=0.01144, 5000=0.00884 (USD); Case/Package: Axial; Min Operating Temperature: -55°C; Max Operating Temperature: 155°C; Package Quantity: 200; Packaging: Bulk; Tolerance: 5%; Resistor Type: Carbon Film; Number of Terminations: 2; Series: Carbon Film; Length: 0.248inch; RoHS Compliant: Yes; Lead Free: Lead Free; ComponentLink1URL: http://www.yageo.com/NewPortal/yageodocoutput?fileName=/pdf/throughhole/Yageo_LR_CFR_2013.pdf&src-supplier=Digi-Key; ComponentLink1Description: http://www.yageo.com/NewPortal/yageodocoutput?fileName=/pdf/throughhole/Yageo_LR_CFR_2013.pdf&src-supplier=Digi-Key; Supplier Part Number 1: 10KQBK-ND
U1-U5 U9 = TL072CP: Dual Low-Noise JFET-Input General-Purpose Operational Amplifier, 7 to 36 V, 0 to 70 degC, 8-pin DIP (P8), Pb-Free (RoHS); Manufacturer: Texas Instruments; Sub Family: General Purpose Amplifier, High Supply Voltage Amplifier (>=30V); Total Supply Voltage(Max)(+5V is 5, +/-5V is 10): 36; Slew Rate(Typ)(V/us): 13; Vn at 1kHz(Typ)(nV/rtHz): 18; GBW(Typ)(MHz): 3; CMRR(Min)(dB): 70; Total Supply Voltage(Min)(+5V is 5, +/-5V is 10): 7; Vio (25C)(Max)(mV): 10; Rating: Catalog; IIB(Max)(pA): 200; Iq per channel(Max)(mA): 2.5; Number of Channels: 2; Mounting Technology: Through Hole; ComponentLink3Description: Package Specification; PartNumber: TL072CP; PackageVersion: 4040082/E, 04/2010; Eco-Plan: Pb-Free (RoHS); DatasheetVersion: SLOS080J; Offset Drift(Typ)(uV/C): 18; ComponentLink3URL: http://www.ti.com/litv/pdf/mpdi001b; PackageDescription: 8-Pin Plastic In-Line, Body 9.59 x 6.35 mm, Pitch 2.54 mm; Code_JEDEC: MS-001; ComponentLink2URL: http://www.ti.com/lit/ds/symlink/tl072.pdf; ComponentLink1Description: Manufacturer URL; ComponentLink2Description: Datasheet; ComponentLink1URL: http://www.ti.com/; PackageReference: P0008A
U6-U8 U10 = NE5532P: Dual Low-Noise High-Speed Audio Operational Amplifier, 10 to 30 V, 0 to 70 degC, 8-pin DIP (P8), Pb-Free (RoHS); Manufacturer: Texas Instruments; Iq per channel(Max)(mA): 4; Slew Rate(Typ)(V/us): 9; Vn at 1kHz(Typ)(nV/rtHz): 5; IIB(Max)(pA): 800000; Total Supply Voltage(Max)(+5V is 5, +/-5V is 10): 30; GBW(Typ)(MHz): 10; CMRR(Min)(dB): 70; Number of Channels: 2; Sub Family: General Purpose Amplifier, High Supply Voltage Amplifier (>=30V), Low Noise Amp (<=10nV/rtHz); ComponentLink2URL: http://www.ti.com/lit/ds/symlink/ne5532.pdf; PackageReference: P0008A; PackageDescription: 8-Pin Plastic In-Line, Body 9.59 x 6.35 mm, Pitch 2.54 mm; ComponentLink1Description: Manufacturer URL; Eco-Plan: Pb-Free (RoHS); Mounting Technology: Through Hole; Code_JEDEC: MS-001; PackageVersion: 4040082/E, 04/2010; DatasheetVersion: SLOS075I; ComponentLink3URL: http://www.ti.com/litv/pdf/mpdi001b; ComponentLink2Description: Datasheet; Vio (25C)(Max)(mV): 4; PartNumber: NE5532P; ComponentLink3Description: Package Specification; Total Supply Voltage(Min)(+5V is 5, +/-5V is 10): 10; ComponentLink1URL: http://www.ti.com/